# EAGLE design b333 (EAGLE 6.4)

## Sheet 1 of 3
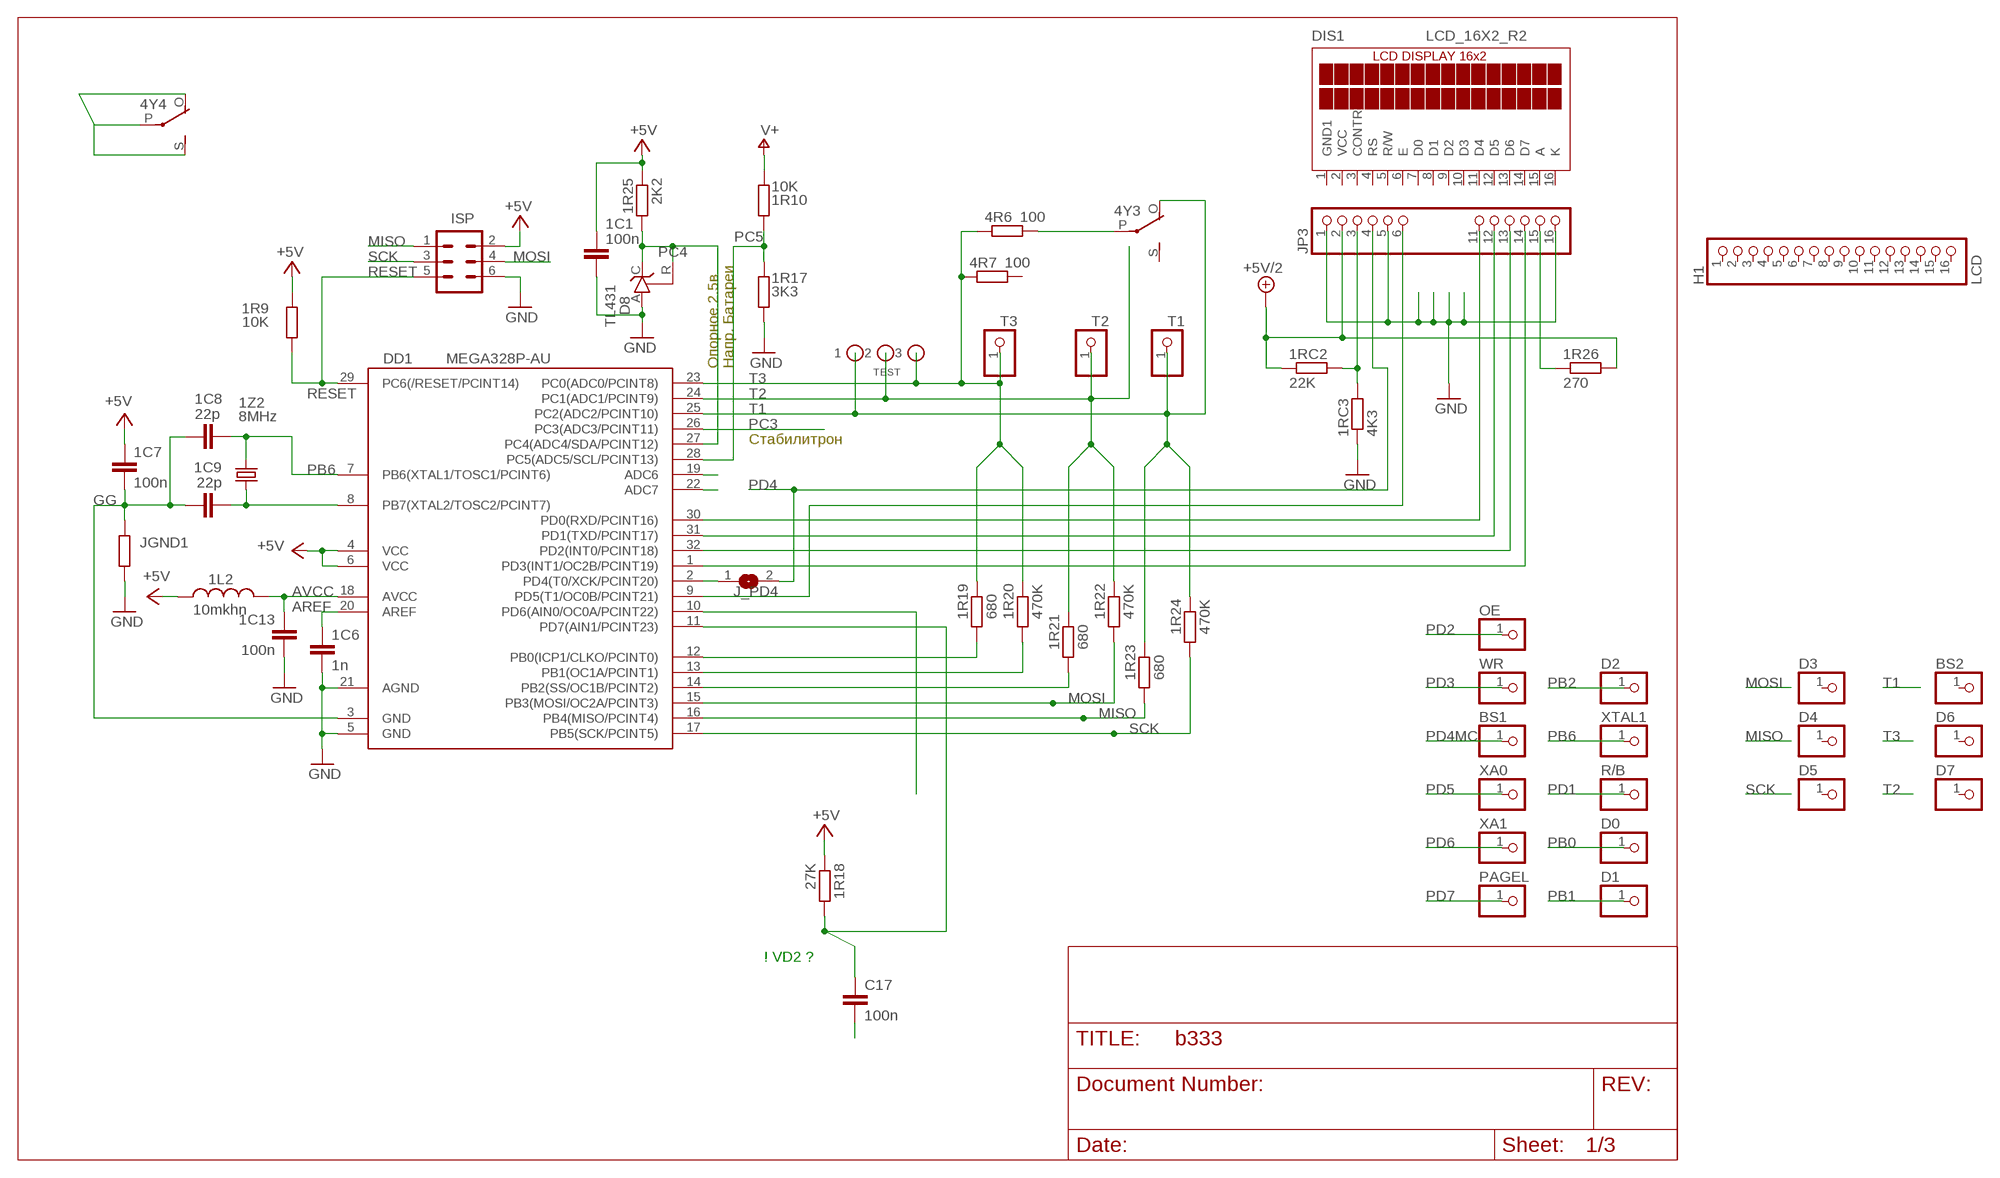
[diagram p0: schematic, sheet 1]

### Parts
1C1  100n  C-EUC0805K  [C0805K]
1C6  1n  C-EUC0805K  [C0805K]
1C7  100n  C-EUC0805K  [C0805K]
1C8  22p  C-EUC0805K  [C0805K]
1C9  22p  C-EUC0805K  [C0805K]
1C13  100n  C-EUC0805K  [C0805K]
1L2  10mkhn  L-USIRF-36  [IRF36]
1R9  10K  R-EU_R0805  [R0805]
1R10  10K  R-EU_R0805  [R0805]
1R17  3K3  R-EU_R1206W  [R1206W]
1R18  27K  R-EU_R0805  [R0805]
1R19  680  R-EU_M0805  [M0805]
1R20  470K  R-EU_M0805  [M0805]
1R21  680  R-EU_M0805  [M0805]
1R22  470K  R-EU_M0805  [M0805]
1R23  680  R-EU_M0805  [M0805]
1R24  470K  R-EU_M0805  [M0805]
1R25  2K2  R-EU_R0805  [R0805]
1R26  270  R-EU_R0805  [R0805]
1RC2  22K  R-EU_R0805  [R0805]
1RC3  4K3  R-EU_R1206W  [R1206W]
1Z2  8MHz  CRYSTALHC49U70  [HC49U70]
4R6  100  R-EU_R0805  [R0805]
4R7  100  R-EU_R0805  [R0805]
4Y3  РЭС55А  [РЭС55А]
4Y4  РЭС55А  [РЭС55А]
BS1  PINHD-1X1  [1X01]
BS2  PINHD-1X1  [1X01]
C17  100n  C-EUC0805K  [C0805K]
D0  PINHD-1X1  [1X01]
D1  PINHD-1X1  [1X01]
D2  PINHD-1X1  [1X01]
D3  PINHD-1X1  [1X01]
D4  PINHD-1X1  [1X01]
D5  PINHD-1X1  [1X01]
D6  PINHD-1X1  [1X01]
D7  PINHD-1X1  [1X01]
D8  TL431  TL431CLP  [TO92-CLP]
DD1  MEGA328P-AU  MEGA48/88/168-AU  [TQFP32-08]
DIS1  LCD_16X2_R2  [LCD_16X2_R2]
H1  LCD  PINHD-1X16  [1X16]
ISP  MA03-2  [MA03-2]
J_PD4  SJ  [SJ]
JGND1  R-EU_R1206W  [R1206W]
JP3  PINHD-X16-8  [1X16-8]
OE  PINHD-1X1  [1X01]
PAGEL  PINHD-1X1  [1X01]
R/B  PINHD-1X1  [1X01]
T1  PINHD-1X1  [1X01]
T2  PINHD-1X1  [1X01]
T3  PINHD-1X1  [1X01]
TEST  TT-P  [TT-P]
WR  PINHD-1X1  [1X01]
XA0  PINHD-1X1  [1X01]
XA1  PINHD-1X1  [1X01]
XTAL1  PINHD-1X1  [1X01]

### Nets
+5V: 1C1.1 1C7.1 1L2.2 1R9.2 1R18.1 1R25.1 DD1.4(VCC) DD1.6(VCC) ISP.2 ; also sheet 2
+5V/2: 1R26.2 1RC2.1 JP3.2 ; also sheet 2
ADC6: DD1.19(ADC6)
ADC7: DD1.22(ADC7)
AREF: 1C6.1 DD1.20(AREF)
AVCC: 1C13.1 1L2.1 DD1.18(AVCC)
GG: 1C7.2 1C8.1 1C9.1 DD1.3(GND) JGND1.2
GND: 1C1.2 1C6.2 1C13.2 1R17.1 1RC3.1 C17.2 D8.A DD1.5(GND) DD1.21(AGND) ISP.6 JGND1.1 JP3.1 JP3.5 JP3.16 ; also sheet 2,3
MISO: 1R23.1 DD1.16(PB4(MISO/PCINT4)) ISP.1
MOSI: 1R22.1 DD1.15(PB3(MOSI/OC2A/PCINT3)) ISP.4
N$1: 4Y4.O 4Y4.P 4Y4.S
N$60: 1RC2.2 1RC3.2 JP3.3
N$61: 1R26.1 JP3.15
N$69: 1C9.2 1Z2.1 DD1.8(PB7(XTAL2/TOSC2/PCINT7))
N$71: 4R6.2 4Y3.P
PB0: 1R19.1 D0.1 DD1.12(PB0(ICP1/CLKO/PCINT0))
PB1: 1R20.1 D1.1 DD1.13(PB1(OC1A/PCINT1))
PB2: 1R21.1 D2.1 DD1.14(PB2(SS/OC1B/PCINT2))
PB6: 1C8.2 1Z2.2 DD1.7(PB6(XTAL1/TOSC1/PCINT6)) XTAL1.1
PC3: DD1.26(PC3(ADC3/PCINT11)) ; also sheet 2
PC4: 1R25.2 D8.C D8.R DD1.27(PC4(ADC4/SDA/PCINT12))
PC5: 1R10.2 1R17.2 DD1.28(PC5(ADC5/SCL/PCINT13))
PD0: DD1.30(PD0(RXD/PCINT16)) JP3.11
PD1: DD1.31(PD1(TXD/PCINT17)) JP3.12 R/B.1
PD2: DD1.32(PD2(INT0/PCINT18)) JP3.13 OE.1
PD3: DD1.1(PD3(INT1/OC2B/PCINT19)) JP3.14 WR.1 ; also sheet 3
PD4: J_PD4.2 JP3.4
PD4MC: BS1.1 DD1.2(PD4(T0/XCK/PCINT20)) J_PD4.1
PD5: DD1.9(PD5(T1/OC0B/PCINT21)) JP3.6 XA0.1
PD6: DD1.10(PD6(AIN0/OC0A/PCINT22)) XA1.1
PD7: 1R18.2 C17.1 DD1.11(PD7(AIN1/PCINT23)) PAGEL.1
RESET: 1R9.1 DD1.29(PC6(/RESET/PCINT14)) ISP.5
SCK: 1R24.1 DD1.17(PB5(SCK/PCINT5)) ISP.3
T1: 1R23.2 1R24.2 4Y3.O DD1.25(PC2(ADC2/PCINT10)) T1.1 TEST.P$1
T2: 1R21.2 1R22.2 DD1.24(PC1(ADC1/PCINT9)) T2.1 TEST.P$2 TEST.P$3 TEST.P$4
T3: 1R19.2 1R20.2 4R6.1 4R7.1 DD1.23(PC0(ADC0/PCINT8)) T3.1 TEST.P$5
V+: 1R10.1 ; also sheet 2
Unconnected: 4R7.2 4Y3.1 4Y3.2 4Y3.G 4Y3.S 4Y4.1 4Y4.2 4Y4.G BS2.1 D3.1 D4.1 D5.1 D6.1 D7.1 DIS1.3(CONTR) DIS1.4(RS) DIS1.5(R/W) DIS1.6(E) DIS1.7(D0) DIS1.8(D1) DIS1.9(D2) DIS1.10(D3) DIS1.11(D4) DIS1.12(D5) DIS1.13(D6) DIS1.14(D7) DIS1.15(A) DIS1.16(K) H1.1 H1.2 H1.3 H1.4 H1.5 H1.6 H1.7 H1.8 H1.9 H1.10 H1.11 H1.12 H1.13 H1.14 H1.15 H1.16

### Notes on the sheet
- Опорное 2.5в | Напр. Батареи
- Стабилитрон
- ! VD2 ?

## Sheet 2 of 3
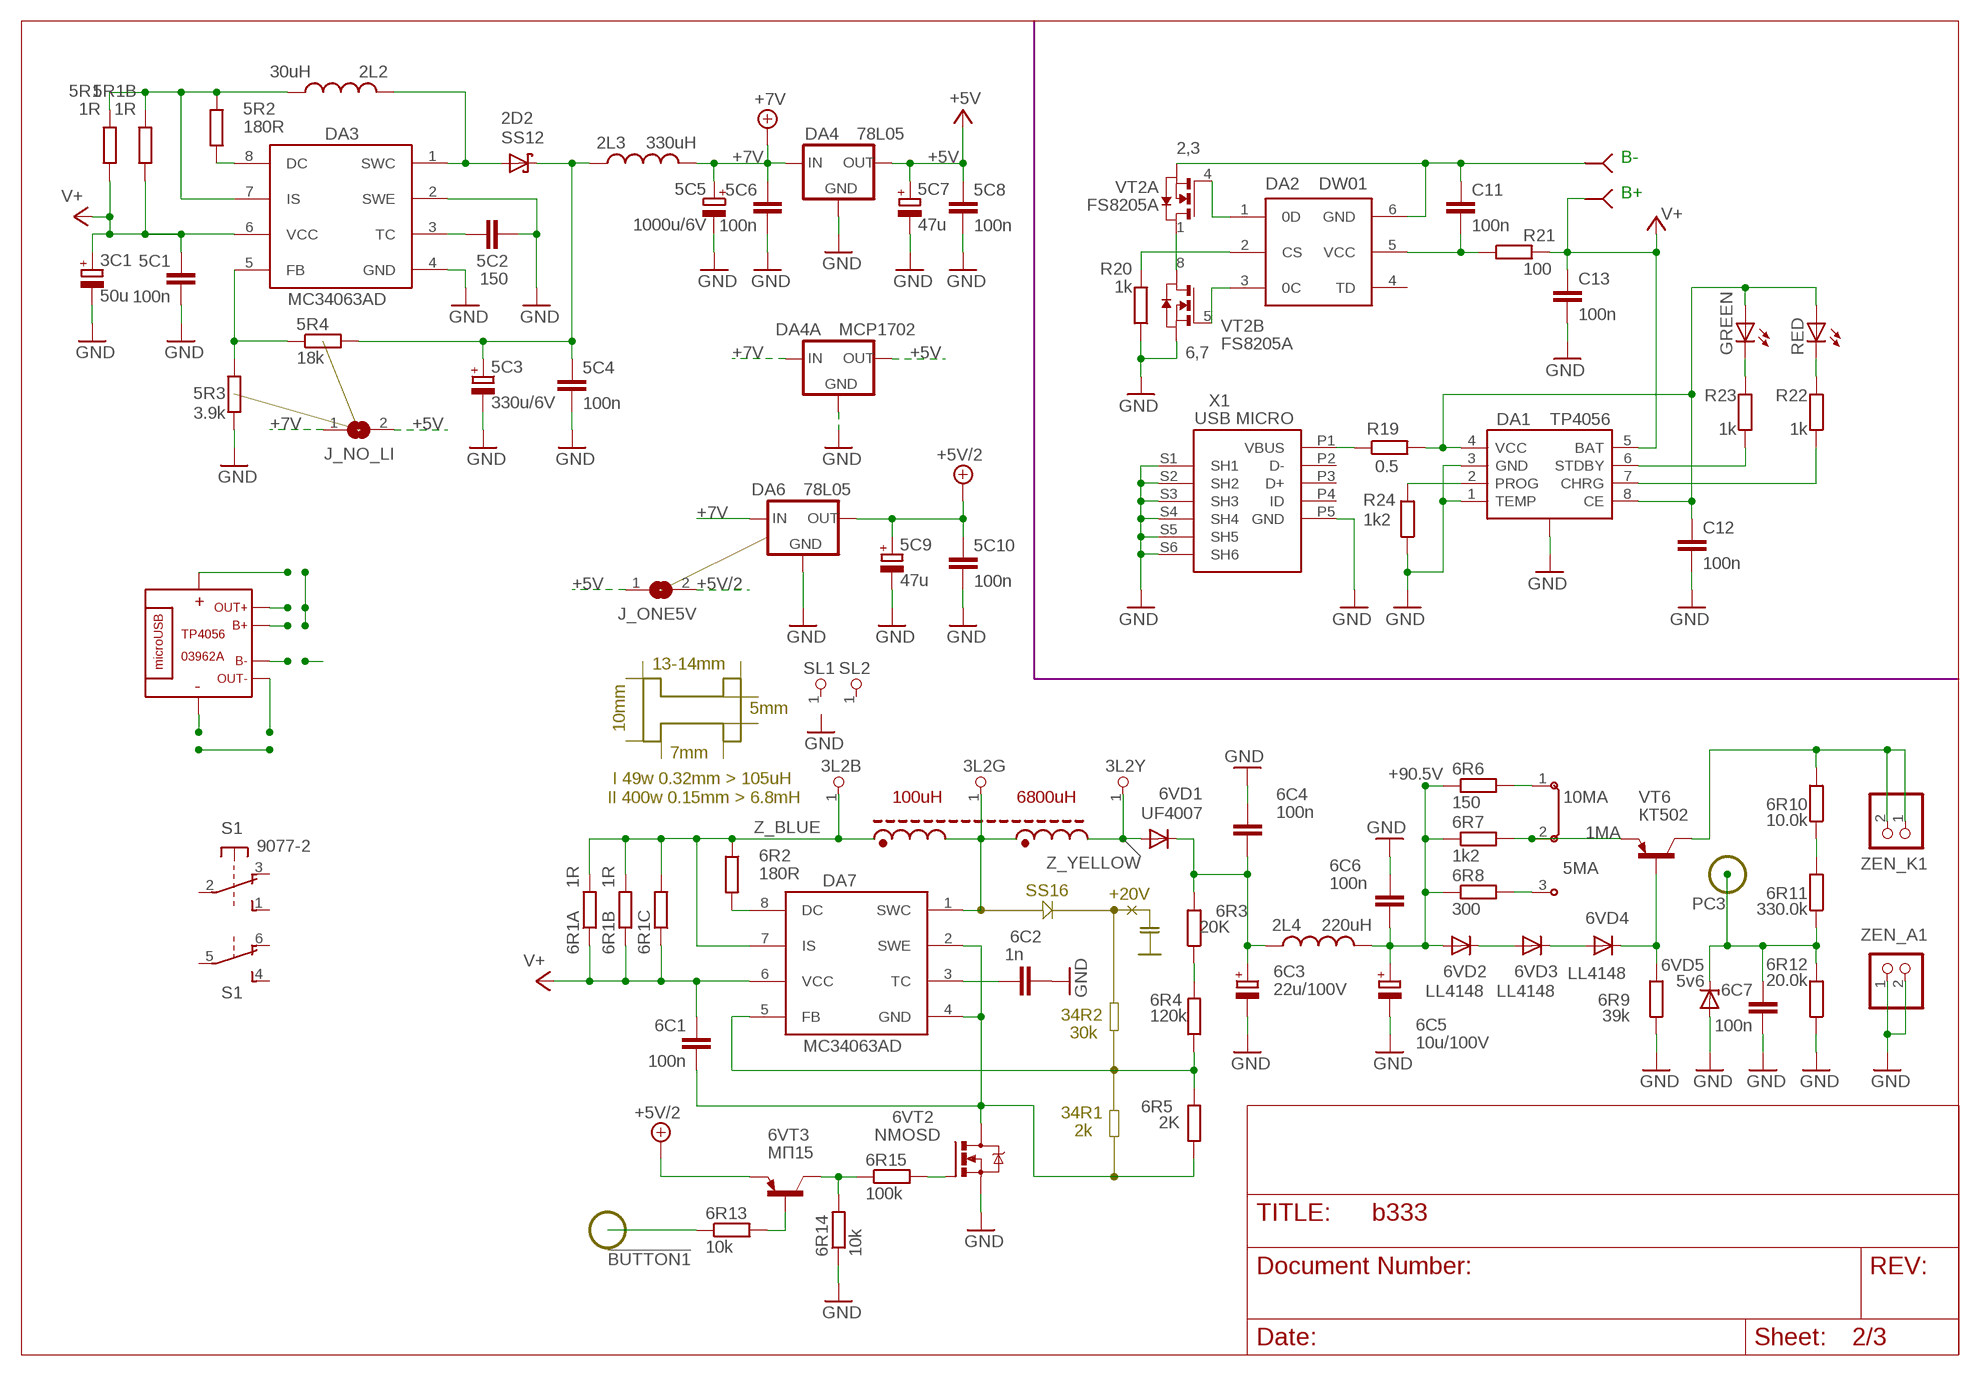
[diagram p1: schematic, sheet 2]

### Parts
2D2  SS12  SCHOTTKY-DIODESMD  [SMB]
2L2  30uH  L_LH7X10MM  [LH7X10MM]
2L3  330uH  L_LV7X10MM  [LV7X10MM]
2L4  220uH  L_LV7X10MM  [LV7X10MM]
3C1  50u  CPOL-EUE2.5-6  [E2,5-6]
3L2B  PINHD-1X1  [1X01]
3L2G  PINHD-1X1  [1X01]
3L2Y  PINHD-1X1  [1X01]
5C1  100n  C-EUC0805K  [C0805K]
5C2  150  C-EUC0805K  [C0805K]
5C3  330u/6V  CPOL-EUE2.5-7  [E2,5-7]
5C4  100n  C-EUC0805K  [C0805K]
5C5  1000u/6V  CPOL-EUE2-5  [E2-5]
5C6  100n  C-EUC0805K  [C0805K]
5C7  47u  CPOL-EUE2.5-6  [E2,5-6]
5C8  100n  C-EUC0805K  [C0805K]
5C9  47u  CPOL-EUE2.5-6  [E2,5-6]
5C10  100n  C-EUC0805K  [C0805K]
5MA  10MA  JUMPERJP2  [JP2]
5R1  1R  R-EU_R1206  [R1206]
5R1B  1R  R-EU_R1206  [R1206]
5R2  180R  R-EU_R0805  [R0805]
5R3  3.9k  R-EU_0204/7  [0204/7]
5R4  18k  R-EU_R0805  [R0805]
6C1  100n  C-EUC0805K  [C0805K]
6C2  1n  C-EUC0805K  [C0805K]
6C3  22u/100V  CPOL-EUTT5D9L  [TT5D9L]
6C4  100n  C-EU050-025X075  [C050-025X075]
6C5  10u/100V  CPOL-EUE2.5-6  [E2,5-6]
6C6  100n  C-EU025-025X050  [C025-025X050]
6C7  100n  C-EU025-025X050  [C025-025X050]
6R1A  1R  R-EU_R1206  [R1206]
6R1B  1R  R-EU_R1206  [R1206]
6R1C  R-EU_R1206  [R1206]
6R2  180R  R-EU_R0805  [R0805]
6R3  20K  R-EU_R0805  [R0805]
6R4  120k  R-EU_R0805  [R0805]
6R5  2K  R-EU_R0805  [R0805]
6R6  150  R-EU_R0805  [R0805]
6R7  1k2  R-EU_R0805  [R0805]
6R8  300  R-EU_R0805  [R0805]
6R9  39k  R-EU_R0805  [R0805]
6R10  10.0k  R-EU_R0805  [R0805]
6R11  330.0k  R-EU_R0805  [R0805]
6R12  20.0k  R-EU_R0805  [R0805]
6R13  10k  R-EU_R1206W  [R1206W]
6R14  10k  R-EU_R0805  [R0805]
6R15  100k  R-EU_R1206W  [R1206W]
6VD1  UF4007  1N4004  [DO41-10]
6VD2  LL4148  DIODE-SOD80C  [SOD80C]
6VD3  LL4148  DIODE-SOD80C  [SOD80C]
6VD4  LL4148  DIODE-SOD80C  [SOD80C]
6VD5  5v6  ZENER-DIODESOD80C  [SOD80C]
6VT2  NMOSD  [DPACK_1]
6VT3  МП15  BF423  [TO92-BCE]
B+  B-  [PAD-]
B-  B-  [PAD-]
C11  100n  C-EUC0805  [C0805]
C12  100n  C-EUC0805  [C0805]
C13  100n  C-EUC0805  [C0805]
DA1  TP4056  [SOP-8]
DA2  DW01A  DW01  [SOT23-6]
DA3  MC34063AD  [SOIC8]
DA4  78L05  78LXX_SOT89  [SOT89R]
DA4A  MCP1702  [SOT89R]
DA6  78L05  78LXX_SOT89  [SOT89R]
DA7  MC34063AD  [SOIC8]
GREEN  LED5MM  [LED5MM]
J_NO_LI  SJ  [SJ]
J_ONE5V  SJ  [SJ]
L  L  [L]
R19  0.5  R-EU_M0805  [M0805]
R20  1k  R-EU_R0805  [R0805]
R21  100  R-EU_R1206W  [R1206W]
R22  1k  R-EU_R0805  [R0805]
R23  1k  R-EU_R0805  [R0805]
R24  1k2  R-EU_0207/10  [0207/10]
RED  LED5MM  [LED5MM]
S1  9077-2  [9077-2]
SL1  PINHD-1X1  [1X01]
SL2  PINHD-1X1  [1X01]
U$5  MOD_TP4056  [MOD_03962A]
VT2  FS8205A  [TSSOP-8]
VT6  КТ502  BF423  [TO92-BCE]
X1  USB MICRO  MYCON2_USB-MINI-B  [CON2_USB_MICRO_B_AT]
ZEN_A1  PINHD-1X2  [1X02]
ZEN_K1  PINHD-1X2  [1X02]

### Nets
1MA: 5MA.2 6R7.2 VT6.E
5: 6R4.1 6R5.2 DA7.5(FB)
!BUTTON1: 6R13.1
+5V: 5C7.+ 5C8.1 DA4.2(OUT) DA4A.1(OUT) J_NO_LI.2 J_ONE5V.1 ; also sheet 1
+5V/2: 5C9.+ 5C10.1 6VT3.E DA6.2(OUT) J_ONE5V.2 ; also sheet 1
+7V: 2L3.2 5C5.+ 5C6.1 DA4.1(IN) DA4A.3(IN) DA4A.4(IN) DA6.1(IN) J_NO_LI.1
+90.5V: 2L4.2 6C5.+ 6C6.2 6R6.1 6R7.1 6R8.1 6VD2.A
B-: B-.B- C11.1 DA2.6(GND) VT2.2(A:S) VT2.3(A:S)
GND: 3C1.- 5C1.2 5C2.2 5C3.- 5C4.2 5C5.- 5C6.2 5C7.- 5C8.2 5C9.- 5C10.2 5R3.1 6C2.2 6C3.- 6C4.1 6C5.- 6C6.1 6C7.2 6R9.1 6R12.1 6R14.1 6VD5.A 6VT2.S C12.2 C13.2 DA1.1(TEMP) DA1.3(GND) DA1.. DA3.2(SWE) DA3.4(GND) DA4.3(GND) DA4.4(GND) DA4A.2(GND) DA6.3(GND) DA6.4(GND) R20.1 R24.1 VT2.6(B:S) VT2.7(B:S) X1.P5(GND) X1.S1(SH1) X1.S2(SH2) X1.S3(SH3) X1.S4(SH4) X1.S5(SH5) X1.S6(SH6) ZEN_A1.1 ZEN_A1.2 ; also sheet 1,3
N$4: R22.2 RED.K(C)
N$5: GREEN.K(C) R23.2
N$8: 5C2.1 DA3.3(TC)
N$9: U$5.P1-
N$10: U$5.P2+B
N$11: U$5.P2-OUT
N$12: 6C1.2 6R5.1 6VT2.D DA7.2(SWE) DA7.4(GND)
N$13: 2D2.A 2L2.1 DA3.1(SWC)
N$14: 2L2.2 5R1.2 5R1B.2 5R2.1 DA3.7(IS)
N$15: 5R2.2 DA3.8(DC)
N$16: 5R3.2 5R4.1 DA3.5(FB)
N$17: 2D2.C 2L3.1 5C3.+ 5C4.1 5R4.2
N$19: 2L4.1 6C3.+ 6C4.2 6R3.2 6VD1.C
N$20: U$5.P2+OUT
N$21: 6R14.2 6R15.1 6VT3.C
N$22: 6C2.1 DA7.3(TC)
N$23: 6R3.1 6R4.2
N$24: 6R10.1 6R11.2
N$25: U$5.P1+
N$27: U$5.P2-B
N$52: 6R2.2 DA7.8(DC)
N$55: 5MA.3 6R8.2
N$59: 5MA.1 6R6.2
N$65: 6VD2.C 6VD3.A
N$66: 6VD3.C 6VD4.A
N$67: 6R9.2 6VD4.C VT6.B
N$75: VT2.1(A:D) VT2.8(B:D)
N$76: DA2.3(0C) VT2.5(B:G)
N$77: DA2.1(0D) VT2.4(A:G)
N$78: DA2.2(CS) R20.2
N$79: C11.2 DA2.5(VCC) R21.1
N$80: DA1.7(CHRG) R22.1
N$81: DA1.6(STDBY) R23.1
N$84: C12.1 DA1.4(VCC) DA1.8(CE) GREEN.A R19.2 RED.A
N$85: R19.1 X1.P1(VBUS)
N$86: DA1.2(PROG) R24.2
N$95: 6R13.2 6VT3.B
N$96: 6R15.2 6VT2.G
PC3: 6C7.1 6R11.1 6R12.2 6VD5.C ; also sheet 1
V+: 3C1.+ 5C1.1 5R1.1 5R1B.1 6C1.1 6R1A.1 6R1B.1 6R1C.1 B+.B- C13.1 DA1.5(BAT) DA3.6(VCC) DA7.6(VCC) R21.2 ; also sheet 1
Z_BLUE: 3L2B.1 6R1A.2 6R1B.2 6R1C.2 6R2.1 DA7.7(IS)
Z_GREEN: 3L2G.1 DA7.1(SWC)
Z_YELLOW: 3L2Y.1 6VD1.A
ZENER: 6R10.2 VT6.C ZEN_K1.1 ZEN_K1.2
Unconnected: DA2.4(TD) S1.1(1:S) S1.2(1:P) S1.3(1:O) S1.4(2:S) S1.5(2:P) S1.6(2:O) SL1.1 SL2.1 X1.P2(D-) X1.P3(D+) X1.P4(ID)

### Notes on the sheet
- 2,3
- B-
- B+
- 6,7
- I 49w 0.32mm > 105uH
  II 400w 0.15mm > 6.8mH
- 100uH | 6800uH
- +20V
- SS16
- 34R2
- 30k
- 34R1
- 2k

## Sheet 3 of 3
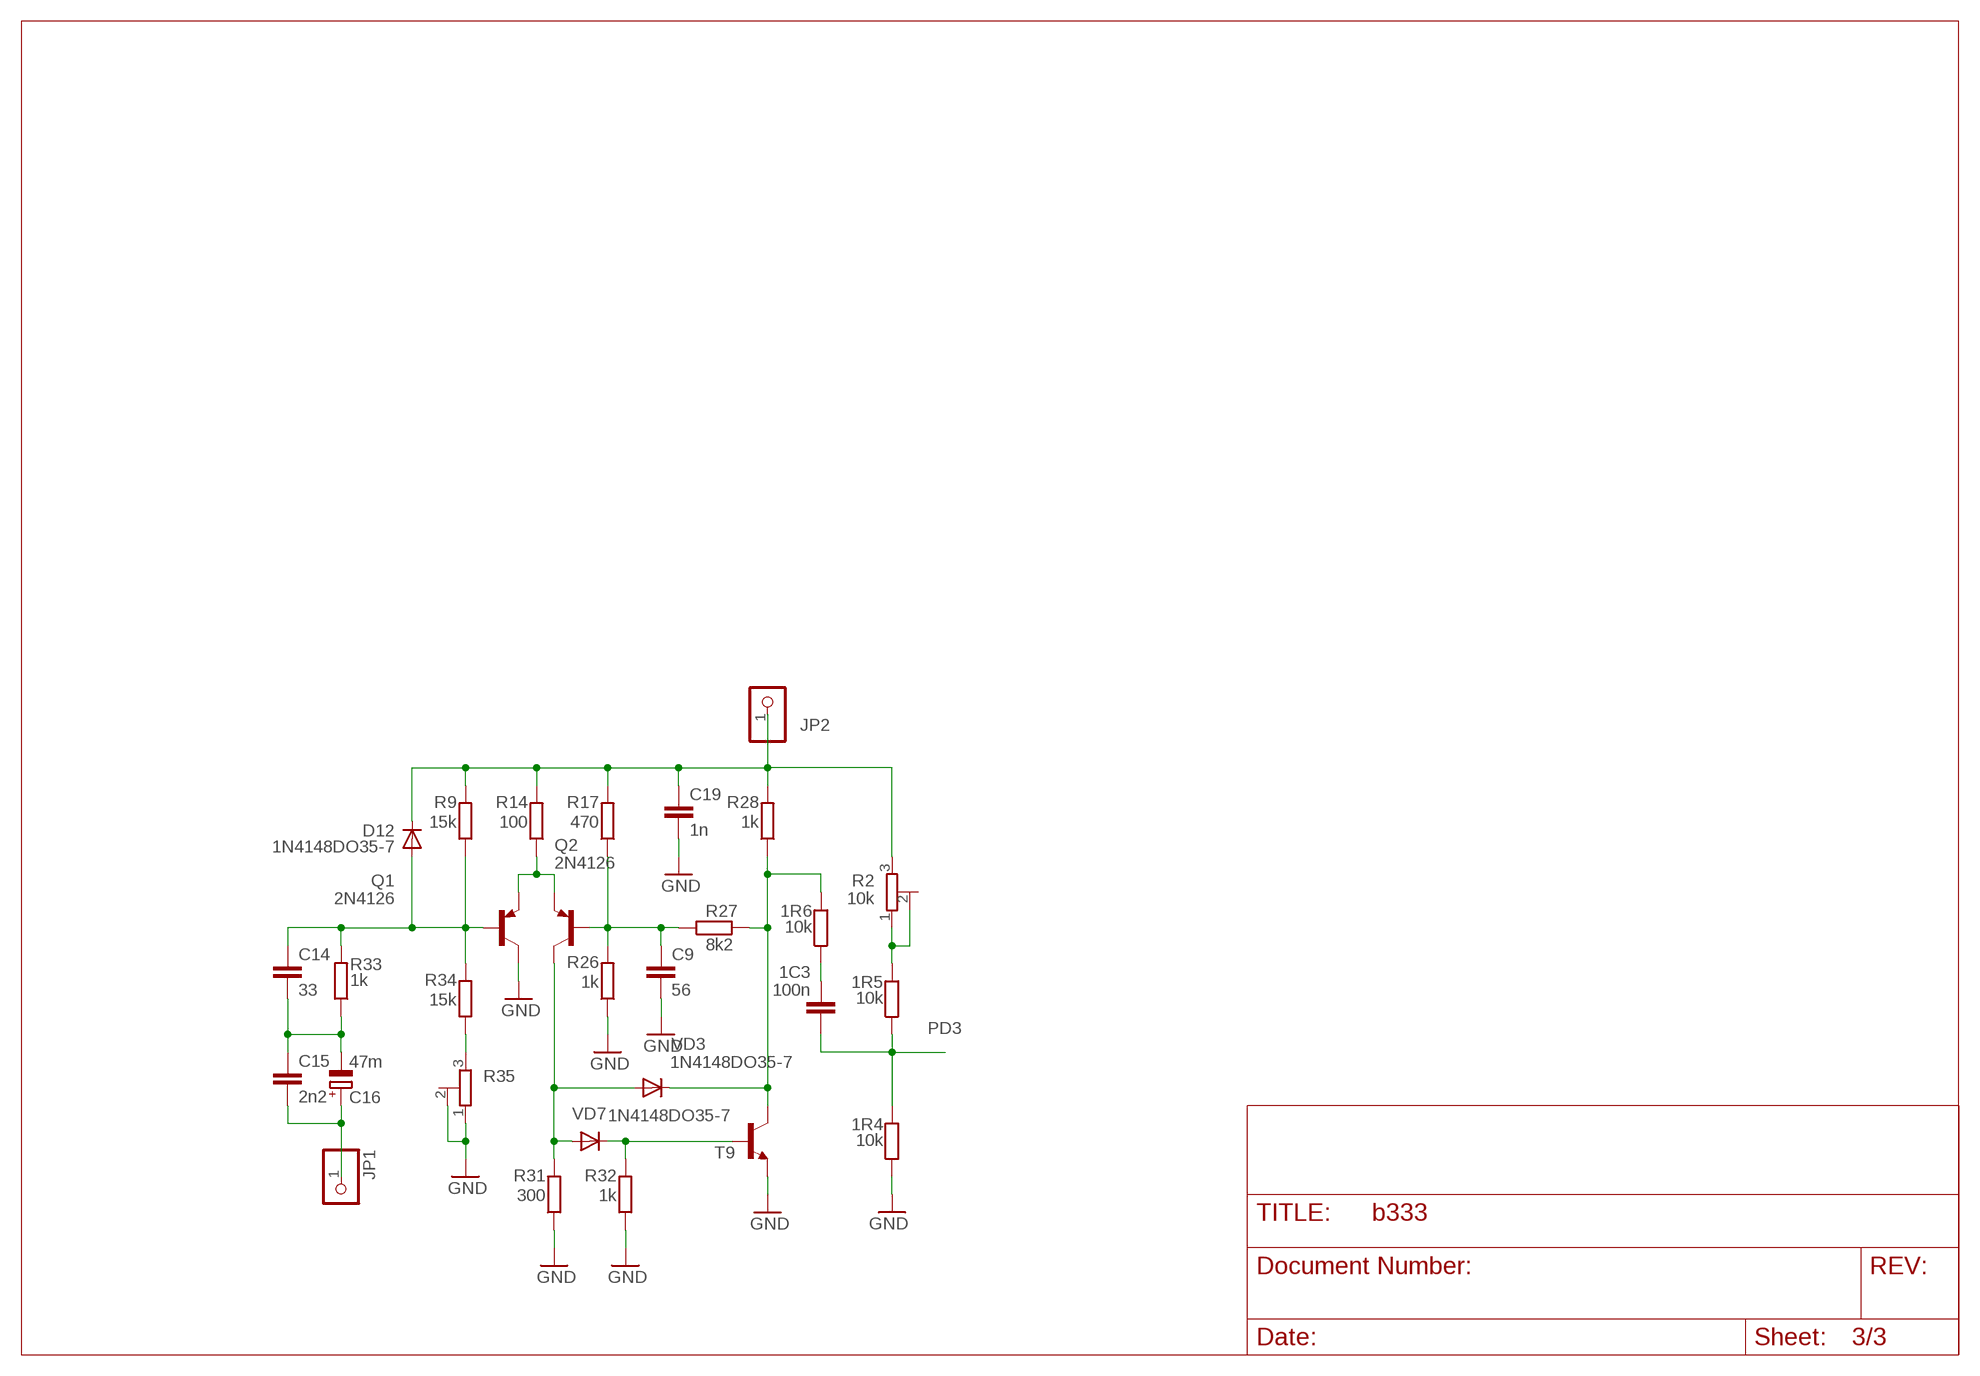
[diagram p2: schematic, sheet 3]

### Parts
1C3  100n  C-EUC0805K  [C0805K]
1R4  10k  R-EU_R0805  [R0805]
1R5  10k  R-EU_R0805  [R0805]
1R6  10k  R-EU_R0805  [R0805]
C9  56  C-EUC0805K  [C0805K]
C14  33  C-EUC0805K  [C0805K]
C15  2n2  C-EUC0805K  [C0805K]
C16  47m  CPOL-EUE2-4  [E2-4]
C19  1n  C-EUC0805K  [C0805K]
D12  1N4148DO35-7  [DO35-7]
JP1  PINHD-1X1  [1X01]
JP2  PINHD-1X1  [1X01]
Q1  2N4126  [TO92-CBE]
Q2  2N4126  [TO92-CBE]
R2  10k  R-TRIMM3296W  [RTRIM3296W]
R9  15k  R-EU_M0805  [M0805]
R14  100  R-EU_M0805  [M0805]
R17  470  R-EU_M0805  [M0805]
R26  1k  R-EU_M0805  [M0805]
R27  8k2  R-EU_M0805  [M0805]
R28  1k  R-EU_M0805  [M0805]
R31  300  R-EU_M0805  [M0805]
R32  1k  R-EU_M0805  [M0805]
R33  1k  R-EU_M0805  [M0805]
R34  15k  R-EU_M0805  [M0805]
R35  R-TRIMM3296W  [RTRIM3296W]
T9  -NPN-TO92-EBC  [TO92-EBC]
VD3  1N4148DO35-7  [DO35-7]
VD7  1N4148DO35-7  [DO35-7]

### Nets
FO: 1R6.2 R27.2 R28.1 T9.C VD3.C
GND: 1R4.1 C9.2 C19.2 Q1.C R26.1 R31.1 R32.1 R35.1(A) R35.2(S) T9.E ; also sheet 1,2
N$2: C19.1 D12.C JP2.1 R2.3(E) R9.2 R14.2 R17.2 R28.2
N$3: R34.1 R35.3(E)
N$6: 1R5.2 R2.1(A) R2.2(S)
N$7: 1C3.1 1R6.1
N$90: Q1.E Q2.E R14.1
N$91: C14.1 D12.A Q1.B R9.1 R33.2 R34.2
N$93: C9.1 Q2.B R17.1 R26.2 R27.1
N$100: Q2.C R31.2 VD3.A VD7.A
N$101: C14.2 C15.1 C16.- R33.1
N$102: R32.2 T9.B VD7.C
N$103: C15.2 C16.+ JP1.1
PD3: 1C3.2 1R4.2 1R5.1 ; also sheet 1

## Power pins joined to a net without a drawn wire
GND1: DIS1.1(GND1)
VCC: DIS1.2(VCC)

## Library data of the parts
1C1 1C3 1C6-1C9 1C13 5C1 5C2 5C4 5C6 5C8 5C10 6C1 6C2 6C4 6C6 6C7 C17 = resistor:C-EU: CAPACITOR, European symbol
1L2 = rcl:L-US: INDUCTOR, American symbol
1R4-1R6 1R9 1R10 1R17-1R26 1RC2 1RC3 4R6 4R7 5R1 5R1B 5R2-5R4 6R1A 6R1B 6R1C 6R2-6R15 R19-R24 = resistor:R-EU_: RESISTOR, European symbol
1Z2 = crystal:CRYSTAL: CRYSTAL; OC_FARNELL: 1666956; OC_NEWARK: unknown
2D2 = diode:SCHOTTKY-DIODE: Schottky Diode
2L2-2L4 = ct-pack:L_: INDUCTOR, American symbol
3C1 5C3 5C5 5C7 5C9 = resistor:CPOL-EU: POLARIZED CAPACITOR, European symbol
3L2B 3L2G 3L2Y SL1 SL2 = b333:PINHD-1X1: PIN HEADER
4Y3 4Y4 = relay_ussr:РЭС55
5MA = ct-pack:JUMPER: Jumper switch 2 x 2.5 mm
6C3 6C5 = ct-pack:CPOL-EU: POLARIZED CAPACITOR, European symbol
6VD1 = diode:1N4004: DIODE general purpose rectifier, 1 A
6VD2-6VD4 = diode:DIODE-: DIODE
6VD5 = diode:ZENER-DIODE: Z-Diode
6VT2 = DSS:NMOS
6VT3 VT6 = transistor-pnp:BF423*: PNP Transistror
B+ B- = TP4056_18650:B-
BS1 BS2 D0 D1-D7 JP1 JP2 OE PAGEL R/B T1-T3 WR XA0 XA1 XTAL1 = pinhead:PINHD-1X1: PIN HEADER
C9 C11-C15 C19 = rcl:C-EU: CAPACITOR, European symbol
C16 = rcl:CPOL-EU: POLARIZED CAPACITOR, European symbol
D8 = v-reg:TL431CLP: VOLTAGE REGULATOR
D12 VD3 VD7 = diode:1N4148: DIODE high speed (Philips)
DA1 = TP4056:TP4056
DA2 = TP4056+:DW01: The DW01-P battery protection IC is designed to protect lithium-ion/polymer battery from damage or degrading the lifetime due to overcharge, overdischarge, and/or overcurrent for one-cell lithium-ion/polymer battery powered systems, such as cellular phones. Data sheet <http://goo.gl/4y108d> Dave.Calaway Eagle Library <https://goo.gl/Muy1Tr>
DA3 DA7 = mc34063-2:MC34063
DA4 DA6 = ct-pack:78LXX: VOLTAGE REGULATOR
DA4A = ct-pack:MCP1702
DD1 = avr-6:MEGA48/88/168
DIS1 = b333:LCD_16X2_R2: Tuxgraphics LCD display 16x2 characters reflective, without background light Source: tuxgr_12x2_r2.pdf; OC_FARNELL: unknown; OC_NEWARK: unknown
GREEN RED = led:LED: LED OSRAM: - CHIPLED LG R971, LG N971, LY N971, LG Q971, LY Q971, LO R971, LY R971 LH N974, LH R974 LS Q976, LO Q976, LY Q976 LO Q996 - Hyper CHIPLED LW Q18S LB Q993, LB Q99A, LB R99A - SideLED LS A670, LO A670, LY A670, LG A670, LP A670 LB A673, LV A673, LT A673, LW A673 LH A674 LY A675 LS A676, LA A676, LO A676, LY A676, LW A676 LS A679, LY A679, LG A679 - Hyper Micro SIDELED® LS Y876, LA Y876, LO Y876, LY Y876 LT Y87S - SmartLED LW L88C, LW L88S LB L89C, LB L89S, LG L890 LS L89K, LO L89K, LY L89K LS L896, LA L896, LO L896, LY L896 - TOPLED LS T670, LO T670, LY T670, LG T670, LP T670 LSG T670, LSP T670, LSY T670, LOP T670, LYG T670 LG T671, LOG T671, LSG T671 LB T673, LV T673, LT T673, LW T673 LH T674 LS T676, LA T676, LO T676, LY T676, LB T676, LH T676, LSB T676, LW T676 LB T67C, LV T67C, LT T67C, LS T67K, LO T67K, LY T67K, LW E67C LS E67B, LA E67B, LO E67B, LY E67B, LB E67C, LV E67C, LT E67C LW T67C LS T679, LY T679, LG T679 LS T770, LO T770, LY T770, LG T770, LP T770 LB T773, LV T773, LT T773, LW T773 LH T774 LS E675, LA E675, LY E675, LS T675 LS T776, LA T776, LO T776, LY T776, LB T776 LHGB T686 LT T68C, LB T68C - Hyper Mini TOPLED® LB M676 - Mini TOPLED Santana® LG M470 LS M47K, LO M47K, LY M47K Source: http://www.osram.convergy.de LUXEON: - LUMILED® LXK2-PW12-R00, LXK2-PW12-S00, LXK2-PW14-U00, LXK2-PW14-V00 LXK2-PM12-R00, LXK2-PM12-S00, LXK2-PM14-U00 LXK2-PE12-Q00, LXK2-PE12-R00, LXK2-PE12-S00, LXK2-PE14-T00, LXK2-PE14-U00 LXK2-PB12-K00, LXK2-PB12-L00, LXK2-PB12-M00, LXK2-PB14-N00, LXK2-PB14-P00, LXK2-PB14-Q00 LXK2-PR12-L00, LXK2-PR12-M00, LXK2-PR14-Q00, LXK2-PR14-R00 LXK2-PD12-Q00, LXK2-PD12-R00, LXK2-PD12-S00 LXK2-PH12-R00, LXK2-PH12-S00 LXK2-PL12-P00, LXK2-PL12-Q00, LXK2-PL12-R00 Source: www.luxeon.com KINGBRIGHT: KA-3528ASYC Source: www.kingbright.com
H1 = pinhead:PINHD-1X16: PIN HEADER
ISP = con-lstb:MA03-2: PIN HEADER
J_NO_LI J_ONE5V J_PD4 = jumper:SJ: SMD solder JUMPER
JGND1 R9 R14 R17 R26-R28 R31-R34 = rcl:R-EU_: RESISTOR, European symbol
JP3 = b333:PINHD-X16-8
L = b333:L
Q1 Q2 = transistor-pnp:2N4126*: PNP Transistror
R2 R35 = ct-pack:R-TRIMM: Trimm resistor
S1 = switch-misc:9077-2: MARQUARDT SWITCH 9077.0200 Distributor: Buerklin <https://www.buerklin.com/default.asp?event=ShowArtikel%2812G2822%29&l=d&jump=ArtNr_12G2822>
T9 = transistor:*-NPN-: NPN Transistror BF959 corrected 2008.03.06
TEST = transistor_tester:TT-P
U$5 = TP4056+mod:MOD_TP4056
VT2 = TP4056+:FS8205A: DUAL N-CHANNEL ENHANCEMENT MODE MOSFET data sheet <http://goo.gl/dRgboR> Dave.Calaway Eagle Library <https://goo.gl/Muy1Tr>
X1 = SmartPrj:MYCON2_USB-MINI-B
ZEN_A1 ZEN_K1 = pinhead:PINHD-1X2: PIN HEADER

## Board
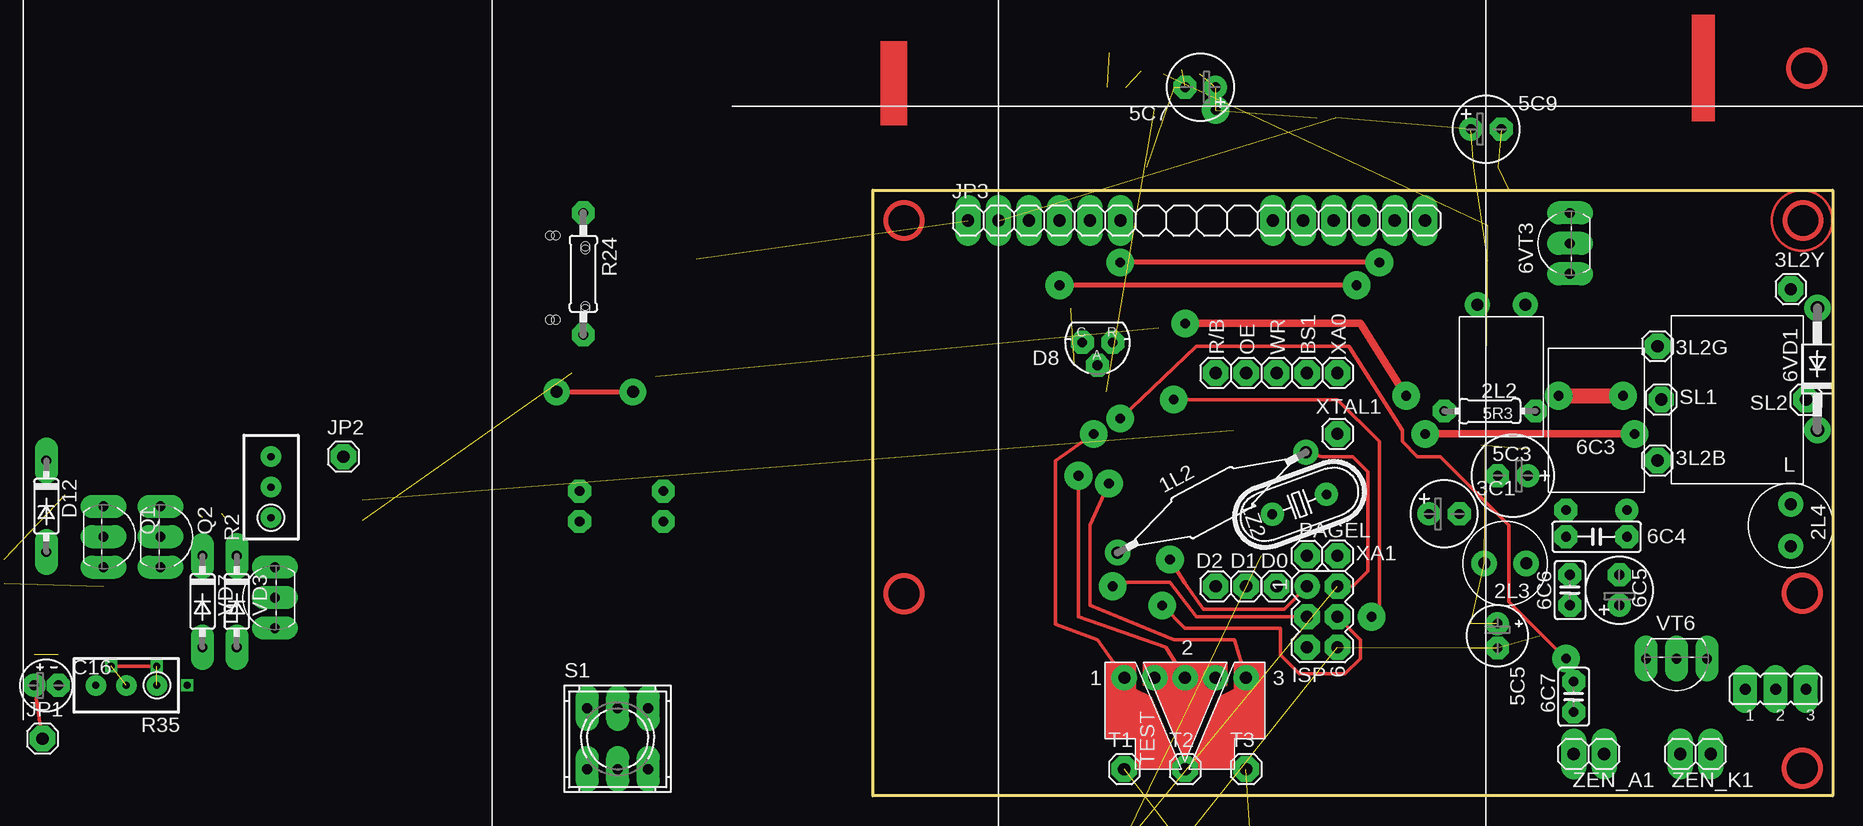
[diagram p3: board, top side]
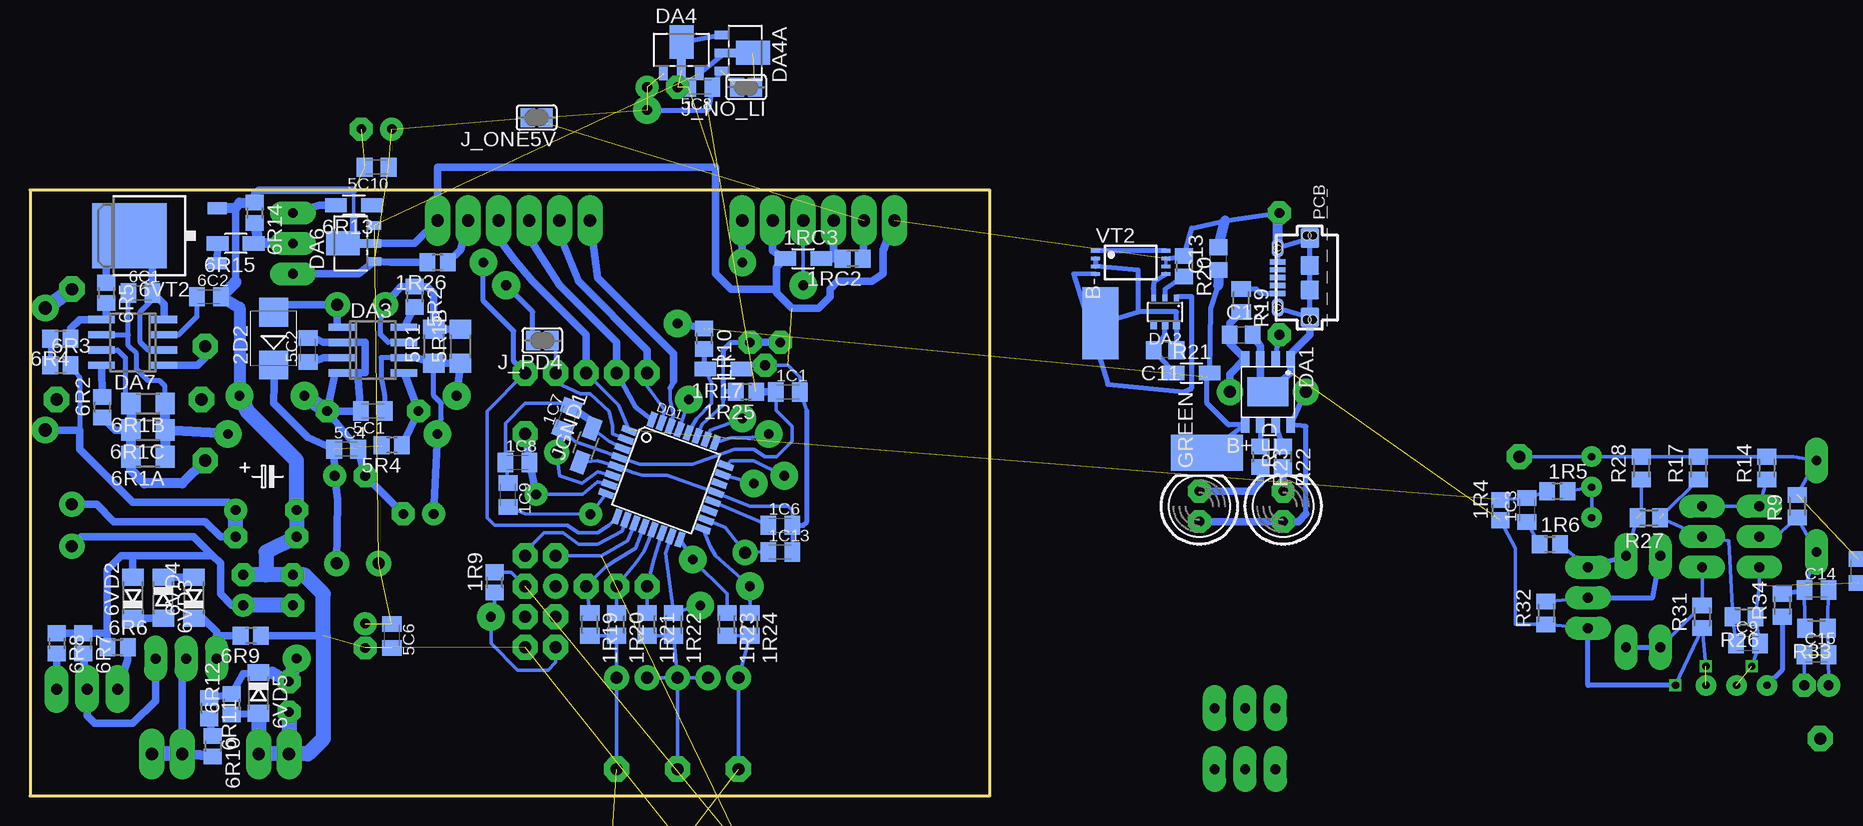
[diagram p4: board, bottom side, seen from below]

Size 80.01 x 50.48 mm. Coordinates in mm from the lower left corner, seen from the top.
Outline: 0,0 0,50.48 80.01,50.48 80.01,0 0,0
Copper layers (1*16): Top 0.035mm / dielectric 1.5mm / Bottom 0.035mm
Design rules "DesignRules": minimum track width 8mil, minimum drill 24mil, track to track 0.2mm, track to pad 0.2mm, pad to pad 8mil, via to via 8mil, smd to smd 8mil, copper to edge 10mil, drill to drill 8mil, minimum pad ring 0.55mm, minimum via ring 8mil, stop-mask expansion 4mil, vias tented up to drill 0mil, thermal gap 10mil

### Footprints (pad centres in the part's own frame; a part is rotated, then mirrored left to right if it is on the bottom)
C0805K = smd 1.3 x 1.6: 1 -1,0; 2 1,0
IRF36 = drill 1 pad 1.676: 1 -8.89,0; 2 8.89,0
R0805 = smd 1.3 x 1.5: 1 -0.85,0; 2 0.85,0
R1206W = smd 1.8 x 1.2: 1 -1.499,0; 2 1.499,0
M0805 = smd 1.3 x 1.6: 1 -0.95,0; 2 0.95,0
HC49U70 = drill 0.813: 1 -2.413,0; 2 2.413,0
SMB = smd 2.4 x 2.4: A 2.2,0; C -2.2,0
LH7X10MM = drill 1: 1 -2,-6; 2 2,-6
LV7X10MM = drill 1: 1 -1.75,0; 2 1.75,0
E2,5-6 = drill 0.813 pad 1.6: + -1.27,0 | drill 0.813 pad 1.6 octagon: - 1.27,0
1X01 = drill 1.016 octagon: 1 0,0
РЭС55А = drill 1.2 pad 2.54 long: 1 13.335,3.175; 2 13.335,-1.905; G 8.255,0.635; S 16.51,0.635 | drill 1 pad 2.54 long: O -12.065,-1.905; P -12.065,3.175
E2,5-7 = drill 0.813 pad 1.6: + -1.27,0 | drill 0.813 pad 1.6 octagon: - 1.27,0
E2-5 = drill 0.813 pad 1.27: + -1.016,0 | drill 0.813 pad 1.27 octagon: - 1.016,0
JP2 = drill 0.914 long: 1 -2.54,0; 2 0,0; 3 2.54,0
R1206 = smd 1.6 x 1.803: 1 -1.422,0; 2 1.422,0
0204/7 = drill 0.813 octagon: 1 -3.81,0; 2 3.81,0
TT5D9L = drill 0.813 pad 1.6: + 2.54,0 | drill 0.813 pad 1.6 octagon: - -2.54,0
C050-025X075 = drill 0.813 octagon: 1 -2.54,0; 2 2.54,0
C025-025X050 = drill 0.813 octagon: 1 -1.27,0; 2 1.27,0
DO41-10 = drill 1.118: A 5.08,0; C -5.08,0
SOD80C = smd 1.4 x 1.8: A 1.7,0; C -1.7,0
DPACK_1 = smd 5.4 x 6.2: D 0,2.5 | smd 1 x 1.6: G -2.28,-4.8; S 2.28,-4.8
TO92-BCE = drill 0.813 long: B 2.54,0; C 0,0; E -2.54,0
PAD- = smd 3 x 6: B- 0,0
C0805 = smd 1.3 x 1.5: 1 -0.95,0; 2 0.95,0
E2-4 = drill 0.813 pad 1.27: + -1.016,0 | drill 0.813 pad 1.27 octagon: - 1.016,0
TO92-CLP = drill 0.813 octagon: A 0,1.905; C 1.27,0; R -1.27,0
DO35-7 = drill 0.813 long: A 3.81,0; C -3.81,0
SOP-8 = smd 1.3 x 0.7: 1 -2.75,1.905; 2 -2.75,0.635; 3 -2.75,-0.635; 4 -2.75,-1.905; 5 2.75,-1.905; 6 2.75,-0.635; 7 2.75,0.635; 8 2.75,1.905 | smd 2.413 x 3.429: . 0,0
SOT23-6 = smd 0.4 x 0.55: 1 -0.95,-1.15; 2 0,-1.15; 3 0.95,-1.15 | smd 0.55 x 0.55: 4 0.95,1.15; 5 0,1.15; 6 -0.95,1.15
SOIC8 = smd 0.6 x 2.2: 1 -1.905,-2.6; 2 -0.635,-2.6; 3 0.635,-2.6; 4 1.905,-2.6; 5 1.905,2.6; 6 0.635,2.6; 7 -0.635,2.6; 8 -1.905,2.6
SOT89R = smd 0.7 x 1.1: 1 1.5,-1.75; 2 -1.5,-1.75 | smd 0.7 x 1.8: 3 0,-1.4 | smd 2 x 2.8: 4 0,0.9
TQFP32-08 = smd 1.27 x 0.559: 1 -4.293,2.8; 2 -4.293,2; 3 -4.293,1.2; 4 -4.293,0.4; 5 -4.293,-0.4; 6 -4.293,-1.2; 7 -4.293,-2; 8 -4.293,-2.8; 17 4.293,-2.8; 18 4.293,-2; 19 4.293,-1.2; 20 4.293,-0.4; 21 4.293,0.4; 22 4.293,1.2; 23 4.293,2; 24 4.293,2.8 | smd 0.559 x 1.27: 9 -2.8,-4.293; 10 -2,-4.293; 11 -1.2,-4.293; 12 -0.4,-4.293; 13 0.4,-4.293; 14 1.2,-4.293; 15 2,-4.293; 16 2.8,-4.293; 25 2.8,4.293; 26 2,4.293; 27 1.2,4.293; 28 0.4,4.293; 29 -0.4,4.293; 30 -1.2,4.293; 31 -2,4.293; 32 -2.8,4.293
LCD_16X2_R2 = drill 1 pad 1.676: 1 -32,15.5; 2 -29.46,15.5; 3 -26.92,15.5; 4 -24.38,15.5; 5 -21.84,15.5; 6 -19.3,15.5; 7 -16.76,15.5; 8 -14.22,15.5; 9 -11.68,15.5; 10 -9.14,15.5; 11 -6.6,15.5; 12 -4.06,15.5; 13 -1.52,15.5; 14 1.02,15.5; 15 3.56,15.5; 16 6.1,15.5 | hole 2.5: -37.5,-15.5; 37.5,-15.5; -37.5,15.5; 37.5,15.5
LED5MM = drill 0.813 octagon: A -1.27,0; K 1.27,0
1X16 = drill 1.016 long: 1 -19.05,0; 2 -16.51,0; 3 -13.97,0; 4 -11.43,0; 5 -8.89,0; 6 -6.35,0; 7 -3.81,0; 8 -1.27,0; 9 1.27,0; 10 3.81,0; 11 6.35,0; 12 8.89,0; 13 11.43,0; 14 13.97,0; 15 16.51,0; 16 19.05,0
MA03-2 = drill 1.016: 1 -2.54,-1.27 | drill 1.016 octagon: 2 -2.54,1.27; 3 0,-1.27; 4 0,1.27; 5 2.54,-1.27; 6 2.54,1.27
SJ = smd 1.168 x 1.6: 1 -0.762,0; 2 0.762,0
1X16-8 = drill 1.016 long: 1 -19.05,0; 2 -16.51,0; 3 -13.97,0; 4 -11.43,0; 5 -8.89,0; 6 -6.35,0; 11 6.35,0; 12 8.89,0; 13 11.43,0; 14 13.97,0; 15 16.51,0; 16 19.05,0
TO92-CBE = drill 0.813 long: B 0,0; C 2.54,0; E -2.54,0
RTRIM3296W = drill 0.61: 1 0,-2.54; 2 0,0; 3 0,2.54
0207/10 = drill 0.813 octagon: 1 -5.08,0; 2 5.08,0
9077-2 = drill 0.813 long: 1 -2.54,2.54; 2 0,2.54; 3 2.54,2.54; 4 -2.54,-2.54; 5 0,-2.54; 6 2.54,-2.54
TO92-EBC = drill 0.813 long: B 0,-1.27; C 2.54,-1.27; E -2.54,-1.27
TT-P = drill 1 pad 2: P$1 -5.08,5.08; P$2 -2.54,5.08; P$3 0,5.08; P$4 2.54,5.08; P$5 5.08,5.08
MOD_03962A = drill 1 pad 2.54 square: P1+ 7,4.88; P1- -7,4.88; P2+B 3.75,-18.12; P2+OUT 7.25,-18.12 | drill 1 pad 2.54: P2-B -3.75,-18.12; P2-OUT -7.25,-18.12
TSSOP-8 = smd 0.3 x 0.75: 1 -0.975,-2.925; 2 -0.325,-2.925; 3 0.325,-2.925; 4 0.975,-2.925; 5 0.975,2.925; 6 0.325,2.925; 7 -0.325,2.925; 8 -0.975,2.925
CON2_USB_MICRO_B_AT = smd 0.406 x 1.346: P1 -1.321,2.692; P2 -0.66,2.692; P3 0,2.692; P4 0.66,2.692; P5 1.321,2.692 | smd 1.651 x 1.549: S1 -3.302,0; S2 3.302,0 | smd 1.524 x 1.016: S3 -2.489,2.692; S4 2.489,2.692 | smd 1.524 x 1.524: S5 -1.016,0; S6 1.016,0 | hole 0.7: -3.505,0.254; -3.505,-0.254; 3.505,0.254; 3.505,-0.254; -2.616,2.692; -2.362,2.692; 2.362,2.692; 2.616,2.692
1X02 = drill 1.016 long: 1 -1.27,0; 2 1.27,0

### Placement (x,y rotation side)
1C1  16.83,33.66 0 bottom
1C3  -44.77,23.81 90 bottom  (outside the outline)
1C6  17.46,22.54 0 bottom
1C7  35.24,31.43 70 bottom
1C8  39.37,27.78 0 bottom
1C9  40.16,25.08 270 bottom
1C13  17.46,20.32 0 bottom
1L2  28.26,24.45 28 top
1R4  -42.55,23.81 90 bottom  (outside the outline)
1R5  -47.31,25.4 0 bottom  (outside the outline)
1R6  -46.67,20.95 0 bottom  (outside the outline)
1R9  41.28,17.78 90 bottom
1R10  23.81,38.1 270 bottom
1R17  22.22,35.56 180 bottom
1R18  12.38,-15.56 0 top  (outside the outline)
1R19  33.34,14.29 270 bottom
1R20  31.11,14.29 270 bottom
1R21  28.58,14.29 270 bottom
1R22  26.35,14.29 270 bottom
1R23  21.91,14.29 270 bottom
1R24  20,14.29 270 bottom
1R25  20.32,33.66 180 bottom
1R26  46.04,44.45 180 bottom
1RC2  11.43,44.77 180 bottom
1RC3  15.56,44.77 0 bottom
1Z2  35.56,24.29 20 top
2D2  59.69,38.1 90 bottom
2L2  52.39,34.92 180 top
2L3  52.71,19.37 180 top
2L4  76.52,22.54 270 top
3C1  47.62,23.49 0 top
3L2B  65.41,27.94 180 top
3L2G  65.41,37.47 0 top
3L2Y  76.52,42.23 0 top
4R6  33.97,-28.26 0 top  (outside the outline)
4R7  29.53,-28.26 0 top  (outside the outline)
4Y3  33.34,-31.75 180 top  (outside the outline)
4Y4  8.57,-17.46 180 top  (outside the outline)
5C1  51.44,32.07 180 bottom
5C2  56.83,37.15 90 bottom
5C3  53.34,26.67 180 top
5C4  53.66,28.89 0 bottom
5C5  52.07,13.33 270 top
5C6  49.85,13.33 270 bottom
5C7  27.31,59.05 180 top  (outside the outline)
5C8  24.13,59.05 180 bottom  (outside the outline)
5C9  51.12,55.56 0 top  (outside the outline)
5C10  51.12,52.39 180 bottom
5MA  75.25,8.89 0 top
5R1  46.35,37.47 90 bottom
5R1B  44.13,37.47 90 bottom
5R2  47.94,41.59 270 bottom
5R3  51.44,32.07 180 top
5R4  49.85,29.21 180 bottom
6C1  70.8,41.91 0 bottom
6C2  65.09,41.59 0 bottom
6C3  60.32,23.81 0 top
6C4  60.32,21.59 0 top
6C5  62.23,17.14 90 top
6C6  58.1,17.14 270 top
6C7  58.42,8.25 270 top
6R1A  70.17,28.26 180 bottom
6R1B  70.17,32.7 180 bottom
6R1C  70.17,30.48 180 bottom
6R2  73.98,32.38 90 bottom
6R3  77.47,35.88 0 bottom
6R4  77.47,38.1 180 bottom
6R5  73.66,41.91 270 bottom
6R6  72.71,12.38 0 bottom
6R7  75.56,12.7 270 bottom
6R8  77.79,12.7 270 bottom
6R9  61.59,13.33 180 bottom
6R10  64.77,4.13 270 bottom
6R11  65.09,7.3 270 bottom
6R12  63.18,7.62 90 bottom
6R13  53.02,49.21 180 bottom
6R14  61.28,48.58 270 bottom
6R15  62.87,46.04 180 bottom
6VD1  78.74,35.56 90 top
6VD2  71.44,16.51 90 bottom
6VD3  68.9,16.51 270 bottom
6VD4  66.36,16.51 90 bottom
6VD5  60.96,8.57 270 bottom
6VT2  69.22,46.67 90 bottom
6VT3  58.1,46.04 90 top
B+  -18.1,28.58 90 bottom  (outside the outline)
B-  -9.21,39.37 180 bottom  (outside the outline)
BS1  36.19,35.24 0 top
BS2  76.2,-13.97 0 top  (outside the outline)
C9  -63.18,12.7 0 bottom  (outside the outline)
C11  -14.61,37.15 180 bottom  (outside the outline)
C12  -20.95,38.42 0 bottom  (outside the outline)
C13  -19.05,44.77 90 bottom  (outside the outline)
C14  -68.9,17.14 0 bottom  (outside the outline)
C15  -68.9,11.75 0 bottom  (outside the outline)
C16  -68.9,9.21 0 top  (outside the outline)
C17  17.46,-13.02 0 top  (outside the outline)
C19  -72.39,18.73 270 bottom  (outside the outline)
D0  33.66,17.46 270 top
D1  31.11,17.46 0 top
D2  28.58,17.46 0 top
D3  76.84,-29.21 0 top  (outside the outline)
D4  75.88,-18.1 0 top  (outside the outline)
D5  46.35,-10.48 0 top  (outside the outline)
D6  75.88,-24.13 0 top  (outside the outline)
D7  42.86,-10.8 0 top  (outside the outline)
D8  18.73,37.78 180 top
D12  -68.9,24.13 270 top  (outside the outline)
DA1  -23.18,33.66 270 bottom  (outside the outline)
DA2  -14.61,40.32 180 bottom  (outside the outline)
DA3  51.44,37.15 270 bottom
DA4  25.72,61.91 0 bottom  (outside the outline)
DA4A  20.64,61.91 270 bottom  (outside the outline)
DA6  53.02,46.04 90 bottom
DA7  71.44,37.78 90 bottom
DD1  26.99,26.35 340 bottom
DIS1  154.31,41.27 0 top  (outside the outline)
GREEN  -17.46,24.13 90 bottom  (outside the outline)
H1  28.26,92.07 0 top  (outside the outline)
ISP  37.47,14.92 270 top
J_NO_LI  20.32,59.05 180 bottom  (outside the outline)
J_ONE5V  37.78,56.52 180 bottom  (outside the outline)
J_PD4  37.31,37.94 180 bottom
JGND1  33.66,29.21 70 bottom
JP1  -69.22,4.76 0 top  (outside the outline)
JP2  -44.13,28.26 0 top  (outside the outline)
JP3  26.99,47.94 0 top
L  72.07,33.02 90 top
OE  31.11,35.24 0 top
PAGEL  36.19,20 180 top
Q1  -64.14,21.59 270 top  (outside the outline)
Q2  -59.37,21.59 270 top  (outside the outline)
R2  -50.16,25.72 0 top  (outside the outline)
R9  -67.31,24.13 90 bottom  (outside the outline)
R14  -64.77,27.3 90 bottom  (outside the outline)
R17  -59.05,27.3 90 bottom  (outside the outline)
R19  -20.95,41.27 270 bottom  (outside the outline)
R20  -16.19,44.13 270 bottom  (outside the outline)
R21  -16.83,35.24 0 bottom  (outside the outline)
R22  -24.45,28.26 270 bottom  (outside the outline)
R23  -22.54,28.26 270 bottom  (outside the outline)
R24  -24.13,43.5 270 top  (outside the outline)
R26  -62.87,14.92 180 bottom  (outside the outline)
R27  -54.93,23.18 180 bottom  (outside the outline)
R28  -54.29,27.3 90 bottom  (outside the outline)
R31  -59.37,14.92 90 bottom  (outside the outline)
R32  -46.35,15.24 90 bottom  (outside the outline)
R33  -68.9,13.97 180 bottom  (outside the outline)
R34  -66.04,15.88 90 bottom  (outside the outline)
R35  -62.23,9.21 90 top  (outside the outline)
R/B  28.58,35.24 0 top
RED  -24.45,24.13 90 bottom  (outside the outline)
S1  -21.27,4.76 0 top  (outside the outline)
SL1  65.72,33.02 0 top
SL2  77.79,33.02 90 top
T1  20.95,2.22 0 top
T2  26.03,2.22 0 top
T3  31.11,2.22 0 top
T9  -51.12,16.51 90 top  (outside the outline)
TEST  26.03,4.76 0 top
U$5  184.79,88.26 0 top  (outside the outline)
U$8  [F18650]  33.97,60.33 0 top  (outside the outline)
U$11  [F18650]  155.89,83.82 0 top  (outside the outline)
VD3  -53.02,16.19 270 top  (outside the outline)
VD7  -55.88,16.19 270 top  (outside the outline)
VT2  -11.75,44.45 270 bottom  (outside the outline)
VT6  66.99,11.43 180 top
WR  33.66,35.24 0 top
X1  -26.67,43.18 90 bottom  (outside the outline)
XA0  38.74,35.24 0 top
XA1  38.74,20 270 top
XTAL1  38.74,30.16 0 top
ZEN_A1  59.69,3.49 180 top
ZEN_K1  68.58,3.49 180 top

### Tracks (layer width: path | path; a pad name or v marks a point on that pad's centre or on a via)
1MA
  Bottom 0.61: 6R7.2 5MA.2 75.25,6.67 74.61,6.03 71.44,6.03 69.53,7.94 VT6.E
5
  Bottom 0.406: 73.66,39.69 DA7.5
  Bottom 0.61: 73.66,39.69 6R5.2 | DA7.5 75.88,39.69 76.62,38.95 6R4.1
+5V  (via drill 0.8 pad 2.3)  (6 unrouted)
  Top 0.305: ISP.2 40,17.46 41.28,18.73 41.28,26.99 40,28.26 37.42,28.26 1L2.2
  Bottom 0.305: 1C1.1 17.83,32.11 16.51,30.8 16.51,29.53 17.78,28.26 18.73,28.26 19.69,28.89 21.27,28.89 24.77,27.62 29.21,27.62 DD1.4 34.61,29.53 1C7.1 | DD1.6 32.7,26.99 33.97,26.03 35.88,26.67 1L2.2 | 1R9.2 39.9,18.63 ISP.2
  Bottom 0.406: v28.58,57.15 23.5,57.15 5C8.1 DA4A.1
  Bottom 0.61: 1C1.1 1R25.1 | 1L2.2 1C7.1
+5V/2  (4 unrouted)
  Bottom 0.61: 1RC2.1 JP3.2 | 6VT3.E 52.63,43.5 DA6.2 49.91,44.45 1R26.2
+7V  (5 unrouted)
  Bottom 0.406: DA4.1 DA4A.3 DA4A.4
+90.5V
  Bottom 0.61: 6R8.1 6R7.1 73.66,13.55 73.56,13.65 | 64.77,20 66.36,21.59 75.72,21.59 2L4.2 | 71.44,20 72.39,20 73.56,18.83 73.56,13.65 | 71.44,20 64.77,20 | 6C5.+ 63.18,15.88 64.13,16.83 64.13,19.37 64.77,20 | 6VD2.A 71.44,20 | 6R6.1 73.56,13.65
  Bottom 1.27: 6C6.2 6C5.+
AREF
  Bottom 0.305: 1C6.1 DD1.20
AVCC
  Bottom 0.305: 1C13.1 1L2.1 22.07,22.38 DD1.18
B-
  Bottom 0.406: C11.1 DA2.6 -15.56,40.32 -12.38,40.32 | -12.38,40.32 -12.38,43.82 VT2.3 VT2.2 | B-.B- -12.38,40.32
FO  (1 unrouted)
  Bottom 0.305: -54.3,23.49 R28.1 | R27.2 VD3.C | 1R6.2 T9.C
  Bottom 0.406: T9.C VD3.C
GG
  Bottom 0.305: 1C9.1 1C8.1 40.37,31.07 38.74,32.7 35.55,32.7 1C7.2 | DD1.3 31.75,29.53 JGND1.2 33.02,31.11
  Bottom 0.61: 1C7.2 33.02,31.11
GND  (via drill 0.6, 0.8 pad 2.3)  (15 unrouted)
  Top 0.305: v-59.69,10.8 v-63.5,10.8
  Top 1.27: v57.15,33.34 v62.55,33.34
  Bottom 0.305: 1C13.2 1C6.2 16.46,23.77 16.83,24.13 20,24.13 DD1.21 26.89,26.72 28.94,26.72 29.68,26.94 DD1.5 32.7,27.94 JGND1.1 | Q1.C -64.14,17.45 R26.1 C9.2 v-63.5,10.8 | v-57.15,9.21 R31.1 v-59.69,10.8 | T9.E R32.1 -43.81,14.29 -43.81,20.64 1R4.1 | DA6.3 DA6.4 | VT2.6 VT2.7 | 15.24,32.07 1C1.2 15.83,34.88 16.83,35.88 D8.A | 20.41,35.88 1R17.1 | 53.02,50.48 53.02,48.26
  Bottom 0.406: DA4A.2 DA4.4 DA4.3 | X1.S3 X1.S1 X1.S5 X1.S6 X1.S2 X1.S4 X1.P5 | v-57.15,9.21 -49.85,9.21 T9.E | 1C6.2 15.56,22.54 15.24,22.86 15.24,32.07 | VT2.7 R20.1 -16.83,47.31 -19.61,47.94 R24.1 | D8.A 20.41,35.88
  Bottom 0.61: 52.71,35.24 52.07,35.24 52.07,37.78 DA3.2 55.56,37.78 56.25,38.15 5C2.2 | 52.71,35.24 DA3.4 54.56,35.24 5R3.1 | 6R9.1 55.56,13.33 | 6R12.1 6VD5.A | 52.71,35.24 5C1.2 5R3.1 | 3C1.- 5C3.- 5C4.2 5R3.1 | 62.87,48.95 62.87,42.82 | 53.02,50.48 60.96,50.48 61.28,50.16 6R14.1 | DA6.3 47.94,46.04 JP3.16 46.04,52.39 22.86,52.39 22.86,43.5 21.59,42.23 17.78,42.23 | JP3.5 18.1,45.4 1RC3.1 17.78,44.04 17.78,42.23 | C12.2 -22.54,37.46 DA1.3 -22.54,33.66 DA1.. -25.08,35.24 DA1.1 -25.08,36.83 -26.67,38.42 X1.S1 | 17.78,42.23 17.78,41.91 16.51,40.64 14.29,40.64 13.33,41.59 13.33,42.23 12.7,42.86 9.84,42.86 8.89,43.5 8.89,45.4 JP3.1 | 53.02,48.26 53.02,46.94 DA6.4
  Bottom 0.813: R24.1 -23.98,48.73 X1.S4 | C13.2 -19.61,47.94 | 6VT2.S 62.87,48.95 62.55,49.43 6R14.1
  Bottom 1.016: v62.55,33.34 62.55,40.69 6C2.2 62.87,42.82
  Bottom 1.27: 60.32,18.41 6C6.1 57.15,18.41 55.56,16.83 55.56,13.33 55.56,4.76 56.83,3.49 ZEN_A1.2 | 60.32,18.41 6C5.- | 6VD5.A ZEN_A1.1 ZEN_A1.2 | 6C7.2 ZEN_A1.2 | 60.32,18.41 60.32,20.32 6C4.1 6C3.- 57.78,27.94 61.91,32.07 v62.55,33.34 | v57.15,33.34 5R3.1
MISO  (via drill 0.8 pad 2.3)
  Top 0.305: ISP.1 34.29,15.56 27.58,15.56 26.03,17.73 v24.77,19.69
  Bottom 0.305: DD1.16 v24.77,19.69 21.91,16.83 1R23.1
MOSI  (via drill 0.8 pad 2.3)
  Top 0.305: ISP.4 40.64,13.02 40.64,11.43 39.37,10.16 35.56,10.16 33.97,11.75 33.97,13.97 26.03,13.97 v24.13,15.88
  Bottom 0.305: DD1.15 27.05,20.22 1R22.1 v24.13,15.88
N$1  (2 unrouted)
N$2  (1 unrouted)
  Bottom 0.305: JP2.1 R2.3 | R2.3 R28.2 R17.2 R14.2 -66.99,28.26 D12.C R9.2 | R2.3
N$3
  Bottom 0.406: R34.1 -66.04,10.48 R35.3
N$4
  Bottom 0.61: RED.K R22.2
N$5
  Bottom 0.61: GREEN.K -21.91,25.4 -22.54,26.03 R23.2
N$6
  Bottom 0.305: 1R5.2 R2.2 R2.1
N$7
  Bottom 0.305: 1R6.1 1C3.1
N$8
  Bottom 0.61: DA3.3 55.51,36.51 56.51,36.15 5C2.1
N$12
  Bottom 0.406: DA7.2 70.17,37.15 70.8,37.78 70.8,40.32 69.8,41.32 6C1.2
  Bottom 0.61: 6R5.1 73.66,44.13 71.12,46.67 6VT2.D 69.8,44.76 6C1.2 68.84,40.94 DA7.4
N$13
  Bottom 0.61: DA3.1 54.39,39.05 2L2.1 59.38,40.93 2D2.A
N$14
  Bottom 0.406: DA3.7 50.16,37.78 50.8,38.42 50.8,39.56 2L2.2
  Bottom 0.61: 5R1B.2 5R1.2 46.35,41.91 46.89,42.44 5R2.1 49.12,42.44 2L2.2
N$15
  Bottom 0.61: 5R2.2 DA3.8
N$16
  Bottom 0.61: DA3.5 5R3.2 5R4.1
N$17  (1 unrouted)
  Bottom 0.61: 2D2.C 59.67,34.29 59.69,32.7 56.88,29.89 5C4.1 5C3.+ 54.36,24.67 2L3.1
N$19
  Bottom 0.406: 6R3.2 75.88,34.82 75.88,30.48
  Bottom 0.61: 6VD1.C 75.88,30.48 75.88,28.89 71.44,24.45 63.5,24.45 6C3.+ | 6C4.2 64.13,21.59 65.41,22.86 73.03,22.86 74.46,24.29 2L4.1
  Bottom 1.27: 6C4.2 6C3.+
N$21
  Bottom 0.61: 60.96,46.04 6R15.1
  Bottom 0.813: 6VT3.C 6R15.1 | 6R14.2 60.96,46.04
N$22
  Bottom 0.406: DA7.3 67.63,38.42 66.09,39.96 6C2.1
N$23
  Bottom 0.406: 6R4.2 6R3.1
N$24
  Bottom 0.61: 6R10.1 6R11.2
N$52
  Bottom 0.61: DA7.8 6R2.2
N$55
  Bottom 0.61: 6R8.2 5MA.3
N$59
  Bottom 0.61: 6R6.2 71.86,11.33 5MA.1
N$60
  Bottom 0.61: 1RC2.2 13.02,44.77 | 13.02,44.77 1RC3.2 | JP3.3 13.02,44.77
N$61
  Bottom 0.61: 1R26.1 44.13,45.5 JP3.15
N$65
  Bottom 0.61: 6VD3.A 6VD2.C
N$66
  Bottom 0.61: 6VD3.C 6VD4.A
N$67
  Bottom 0.61: 64.45,13.33 64.45,13.65 65.61,14.81 6VD4.C | 6R9.2 64.45,13.33 | 64.45,13.33 VT6.B
N$69
  Bottom 0.305: DD1.8 1Z2.1 38.74,23.49 1C9.2
N$71  (1 unrouted)
N$75
  Bottom 0.406: VT2.8 VT2.1
N$76
  Bottom 0.406: VT2.5 -13.72,42.86 -13.65,42.23 DA2.3
N$77
  Bottom 0.406: VT2.4 -6.98,43.5 -9.84,34.29 -16.19,33.66 -16.83,33.97 -16.83,41.59 -15.67,41.59 DA2.1
N$78
  Bottom 0.406: R20.2 -14.61,42.23 DA2.2
N$79
  Bottom 0.406: DA2.5 -14.61,38.42 C11.2 R21.1
N$80
  Bottom 0.406: DA1.7 R22.1
N$81
  Bottom 0.406: DA1.6 R23.1
N$84  (via drill 1 pad 2.18)
  Top 0.406: v-26.35,33.66 v-20,33.66
  Bottom 0.406: v-26.35,33.66 DA1.8 -26.35,30.8 -26.35,23.49
  Bottom 0.61: v-20,33.66 -20,35.13 DA1.4 -20,37.67 C12.1 -20,39.38 R19.2 | GREEN.A RED.A -25.72,22.86 -26.35,23.49
N$85
  Bottom 0.406: X1.P1 -22.59,41.86 -22.22,42.23 R19.1
N$86
  Bottom 0.406: DA1.2 R24.2
N$90
  Bottom 0.305: Q2.E Q1.E R14.1
N$91
  Bottom 0.305: Q1.B -65.09,21.27 R9.1 D12.A C14.1 -67.95,14.6
  Bottom 0.406: R34.2 C14.1 | R33.2 -67.95,14.6
N$93  (1 unrouted)
  Bottom 0.305: R27.1 Q2.B -61.59,21.27 R26.2 C9.1 | -56.2,23.49 R17.1
N$95
  Bottom 0.61: 6R13.2 55.88,49.21 6VT3.B
N$96
  Bottom 0.61: 6R15.2 6VT2.G
N$100
  Bottom 0.305: Q2.C R31.2 VD7.A
  Bottom 0.406: VD3.A VD7.A
N$101  (1 unrouted)
  Bottom 0.305: R33.1 -69.9,11.75 | -69.85,14.6 C14.2 | C15.1 C16.-
  Bottom 0.406: R33.1 -69.85,14.6
N$102
  Bottom 0.305: R32.2 T9.B
  Bottom 0.406: T9.B -55.24,16.51 VD7.C
N$103
  Top 0.305: C16.+ JP1.1
  Bottom 0.305: C15.2 C16.+
PB0
  Bottom 0.305: DD1.12 29.53,20.64 31.11,19.69 32.07,19.05 D0.1 1R19.1
PB1
  Bottom 0.305: DD1.13 28.81,20.4 29.53,19.37 D1.1 1R20.1
PB2
  Bottom 0.305: DD1.14 28.01,19.75 D2.1 1R21.1
PB6
  Bottom 0.305: DD1.7 32.7,26.19 33.94,25.11 1Z2.2
  Bottom 0.61: XTAL1.1 1C8.2 1Z2.2
PC3  (via drill 0.8 pad 2.3)
  Top 0.305: v20.64,31.43 26.99,37.47 39.69,37.47 44.13,30.48 44.13,29.53 45.4,28.26 47.31,28.26 53.02,22.54 53.02,16.19 v57.78,11.43
  Bottom 0.305: DD1.26 23.34,30.48 v20.64,31.43
  Bottom 0.61: 6R11.1 6R12.2 62.23,10.16 6VD5.C
  Bottom 1.016: 6VD5.C 59.8,10.27 6C7.1
  Bottom 1.27: 6C7.1 v57.78,11.43
PC4
  Bottom 0.305: DD1.27 23.97,30.96 22.22,32.54 22.22,33.02 | 22.22,36.51 22.22,34.61
  Bottom 0.406: 22.22,33.66 22.22,33.02 | 1R25.2 22.22,33.66 | D8.R 21.59,37.78 22.22,37.15 22.22,36.51 | 22.22,34.61 22.22,33.66
  Bottom 0.61: D8.C D8.R
PC5
  Bottom 0.305: DD1.28 24.45,31.43 23.18,32.7 23.18,34.38 1R17.2
  Bottom 0.406: 1R17.2 1R10.2
PD0
  Bottom 0.305: DD1.30 26.35,31.75 26.67,33.02 26.67,33.97
  Bottom 0.406: 26.35,34.61 26.67,33.97
  Bottom 0.61: JP3.11 32.7,43.18 26.35,36.83 26.35,34.61
PD1
  Bottom 0.305: DD1.31 27.15,31.91 27.15,32.23 28.58,34.13 R/B.1
  Bottom 0.61: R/B.1 28.58,37.15 34.29,42.86 35.56,46.04 JP3.12
PD2
  Bottom 0.406: DD1.32 29.53,32.38 OE.1
  Bottom 0.61: OE.1 31.11,37.78 35.88,42.55 38.1,46.04 JP3.13
PD3  (1 unrouted)
  Bottom 0.305: 1R5.1 1C3.2 1R4.2 | DD1.1 30.96,32.54 WR.1
  Bottom 0.61: WR.1 33.66,38.42 38.1,42.86 39.69,44.77 40.64,46.04 JP3.14
PD4  (via drill 0.8 pad 2.3)
  Top 0.406: v40.32,42.55 v15.56,42.55
  Bottom 0.305: 38.1,37.97 J_PD4.2 | JP3.4 v15.56,42.55
  Bottom 0.406: 38.1,37.97 38.1,40.32 v40.32,42.55
PD4MC
  Bottom 0.305: J_PD4.1 36.19,37.27 BS1.1 36.19,34.45 34.13,33.5 33.34,33.5 31.75,32.07 31.43,30.8 31.43,30.16 DD1.2
PD5  (via drill 0.8 pad 2.3)
  Top 0.406: v42.23,44.45 v20.64,44.45
  Bottom 0.305: XA0.1 41.91,32.07 41.91,23.18 41.28,22.54 35.24,22.54 34.29,21.91 32.7,21.91 31.75,22.54 DD1.9
  Bottom 0.406: XA0.1 39.69,36.19 39.69,38.74 42.23,41.27 v42.23,44.45
  Bottom 0.61: v20.64,44.45 JP3.6
PD6
  Bottom 0.305: DD1.10 30.66,22.05 32.7,20.96 34.29,20.96 35.56,21.91 37.15,21.91 38.1,20.96 XA1.1
PD7  (2 unrouted)
  Bottom 0.305: DD1.11 30.19,21.25 32.39,20 PAGEL.1
RESET  (via drill 0.8 pad 2.3)
  Top 0.305: v25.08,33.02 38.74,33.02 42.23,29.53 42.23,15.56 v41.59,14.92
  Bottom 0.305: v25.08,33.02 DD1.29 | ISP.5 36.19,11.11 36.83,10.48 39.37,10.48 41.59,12.7 v41.59,14.92 41.28,15.88 1R9.1
SCK  (via drill 0.8 pad 2.3)
  Top 0.305: ISP.3 26.99,14.92 24.77,17.78 20.32,17.78 v20,17.46
  Bottom 0.305: DD1.17 23.33,20.79 22.86,20 v20,17.46 1R24.1
T1  (via drill 0.8 pad 2.3)  (1 unrouted)
  Top 0.305: v18.42,30.16 15.24,27.94 15.24,14.29 18.73,13.02 TEST.P$1
  Bottom 0.305: 1R23.2 1R24.2 TEST.P$1 T1.1 | DD1.25 21.59,29.85 20,29.85 v18.42,30.16
T2  (via drill 0.8 pad 2.3)
  Top 0.305: TEST.P$3 24.45,12.38 17.14,14.92 v17.14,26.67
  Bottom 0.305: 1R21.2 1R22.2 TEST.P$3 | v17.14,26.67 19.69,27.94 21.57,27.94 DD1.24 | TEST.P$2 TEST.P$3 | TEST.P$4 TEST.P$3 | TEST.P$3 T2.1
T3  (via drill 0.8 pad 2.3)  (2 unrouted)
  Top 0.305: v19.69,26.03 18.1,22.54 18.1,15.88 25.08,13.02 30.16,13.02 TEST.P$5
  Bottom 0.305: 1R19.2 1R20.2 TEST.P$5 T3.1 | v19.69,26.03 DD1.23
V+  (via drill 0.8 pad 2.3)  (1 unrouted)
  Top 0.61: v63.5,30.16 v46.04,30.16 | v44.45,33.34 40.64,39.37 v26.03,39.37
  Bottom 0.406: DA7.6 71.8,38.42 | 71.8,38.42 6C1.1 | 6R1B.1 68.75,34.14 69.22,34.61 70.17,34.61 71.12,35.56 71.12,36.83 71.8,37.51 71.8,38.42 | DA3.6 50.75,36.51 50.75,34.88 50.44,33.29 5C1.1 | B+.B- DA1.5 -19.89,30.91 -18.1,32.7 -18.1,34.93 R21.2 -18.42,40.64 -19.05,42.55 | v46.04,30.16 45.72,31.43 45.72,32.7 46.35,33.34 5R1.1
  Bottom 0.61: v46.04,30.16 3C1.+ | DA3.6 47.78,36.51 5R1.1 5R1B.1 v44.45,33.34 | v26.03,39.37 1R10.1
  Bottom 0.813: v63.5,30.16 6R1C.1 | 6R1C.1 6R1B.1 | 6R1C.1 6R1A.1 | C13.1 -19.05,42.55
Z_BLUE
  Bottom 0.406: DA7.7 72.71,37.15 72.07,36.51 72.07,33.19 6R1B.2
  Bottom 0.61: 6R1C.2 72.92,30.48 6R2.1
  Bottom 0.813: 6R1B.2 6R1C.2 6R1A.2 71.59,27.14 70.49,26.03 67.31,26.03 3L2B.1
Z_GREEN
  Bottom 0.61: DA7.1 66.04,35.88 65.41,36.51 3L2G.1
Z_YELLOW
  Bottom 1.27: 6VD1.A 3L2Y.1
ZENER
  Bottom 0.61: ZEN_K1.2 67.31,11.11 VT6.C
  Bottom 0.813: 6R10.2 ZEN_K1.2
  Bottom 1.27: ZEN_K1.2 ZEN_K1.1
(copper drawn outside any net)
  shapes: Top area x2, Top circle x8